# Altium schematic sheet Mic.SchDoc
size A
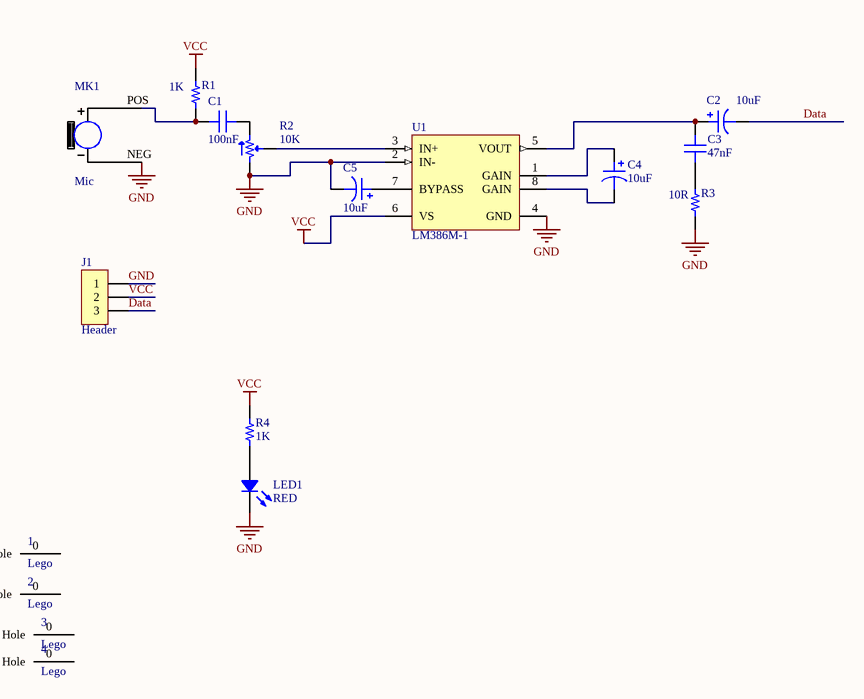
[diagram p0: Mic.SchDoc]

## Parts
1  Lego  [Lego Hole]
2  Lego  [Lego Hole]
3  Lego  [Lego Hole]
4  Lego  [Lego Hole]
C1  100nF  [CAP 1206/3216]
C2  10uF  [CAP ALUM 6.6MM]
C3  47nF  [CAP 1206/3216]
C4  10uF  [CAP ALUM 6.6MM]
C5  10uF  [CAP ALUM 6.6MM]
J1  Header  [MOLEX SDA-70553-3PIN]
LED1  RED  [LED 1206/3216 RED]
MK1  Mic  [Mic]
R1  1K  [RES 1206/3216]
R2  10K  [POT Panasonic EVM]
R3  10R  [RES 1206/3216]
R4  1K  [RES 1206/3216]
U1  LM386M-1  [M08A_M]

## Nets
GND: C5.2 J1.1 LED1.2 MK1.NEG R2.1 R3.1 U1.2(IN-) U1.4(GND)
VCC: J1.2 R1.2 R4.2 U1.6(VS)
Data: C2.2 J1.3
NetC1_1: C1.1 MK1.POS R1.1
NetC1_2: C1.2 R2.3
NetC2_1: C2.1 C3.2 U1.5(VOUT)
NetC3_1: C3.1 R3.2
NetC4_1: C4.1 U1.1(GAIN)
NetC4_2: C4.2 U1.8(GAIN)
NetC5_1: C5.1 U1.7(BYPASS)
NetLED1_1: LED1.1 R4.1
NetR2_2: R2.2 U1.3(IN+)

Not connected (* = marked no-connect by the designer): 1 0(Lego_Hole); 2 0(Lego_Hole); 3 0(Lego_Hole); 4 0(Lego_Hole)

## Library data of the parts
C1 C3 = Capacitor: SMT Capacitor; Value: 0.1uF
C2 C4 C5 = Polarised Capacitor: SMT Polarised Capacitor; Value: 10uF
J1 = 3 Pin
LED1 = LED: Chip LED; Value: Green
MK1 = Mic: MIC COND ANALOG OMNI -38DB; MF: PUI; MP: AOM-6738P-R; Package: None; Availability: Good; Price: 1.06 USD; Value: *
R1 R4 = Resistor: SMT Resistor; Value: 1K
R2 = Potentiometer: Value: 10k
R3 = Resistor: SMT Resistor; Value: 1K
U1 = LM386M-1: Low Voltage Audio Power Amplifier, 8-pin Narrow SOIC; Manufacturer: National Semiconductor; PackageTopMarking: NSZXTT*LM386*M-1; PowerWise: N; CompType: Audio IC; High-Reliability: Y; DatasheetVersion: Aug-2000; PackageVersion: revM, May-2009; PackageReference: M08A; PackageDescription: SOIC Narrow, 4.9 x 3.9 x 1.45mm, 8 Lead, 1.27mm Pitch; PartNumber: LM386M-1; RoHS: N; PinCount: 8; Code_JEDEC: MS-012-AA; Code_IPC: SOIC127P600-8; ComponentLink1Description: Manufacturer URL; ComponentLink1URL: http://www.national.com/; ComponentLink2Description: LM386 Datasheet; ComponentLink2URL: http://www.national.com/ds/LM/LM386.pdf; ComponentLink3Description: LM386 Web Page; ComponentLink3URL: http://www.national.com/pf/LM/LM386.html; ComponentLink4Description: M08A Package Page; ComponentLink4URL: http://www.national.com/packaging/folders/m08a.html